# EAGLE schematic schematic (EAGLE 9.0.0)
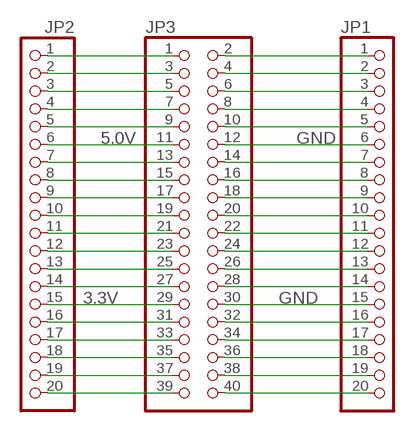
[diagram p0: schematic, sheet 1]

## Parts
JP1  PINHD-1X20  [1X20]
JP2  PINHD-1X20  [1X20]
JP3  PINHD-2X20  [2X20]

## Nets
3.3V: JP2.15 JP3.29
5.0V: JP2.6 JP3.11
GND: JP1.6 JP1.15 JP3.12 JP3.30
N$1: JP2.1 JP3.1
N$2: JP2.2 JP3.3
N$3: JP2.3 JP3.5
N$4: JP2.4 JP3.7
N$5: JP2.5 JP3.9
N$7: JP2.7 JP3.13
N$8: JP2.8 JP3.15
N$9: JP2.9 JP3.17
N$10: JP2.10 JP3.19
N$11: JP2.11 JP3.21
N$12: JP2.12 JP3.23
N$13: JP2.13 JP3.25
N$14: JP2.14 JP3.27
N$16: JP2.16 JP3.31
N$17: JP2.17 JP3.33
N$18: JP2.18 JP3.35
N$19: JP2.19 JP3.37
N$20: JP2.20 JP3.39
N$21: JP1.1 JP3.2
N$22: JP1.2 JP3.4
N$23: JP1.3 JP3.6
N$24: JP1.4 JP3.8
N$25: JP1.5 JP3.10
N$27: JP1.7 JP3.14
N$28: JP1.8 JP3.16
N$29: JP1.9 JP3.18
N$30: JP1.10 JP3.20
N$31: JP1.11 JP3.22
N$32: JP1.12 JP3.24
N$33: JP1.13 JP3.26
N$34: JP1.14 JP3.28
N$36: JP1.16 JP3.32
N$37: JP1.17 JP3.34
N$38: JP1.18 JP3.36
N$39: JP1.19 JP3.38
N$40: JP1.20 JP3.40

## Library data of the parts
JP1 JP2 = 1X20_pinheader:PINHD-1X20: PIN HEADER
JP3 = 2X20_pinheader:PINHD-2X20: PIN HEADER